# EasyEDA Pro project ProDocument_1_2024-06-25.epro

# Schematic Schematic2
Create Date: 2024-06-14; Page Name: P1; Project Name: 32血氧课设; Schematic Name: Schematic2; Update Date: 2024-06-15; Company: 嘉立创EDA; Page Size: A4; Version: V1.0
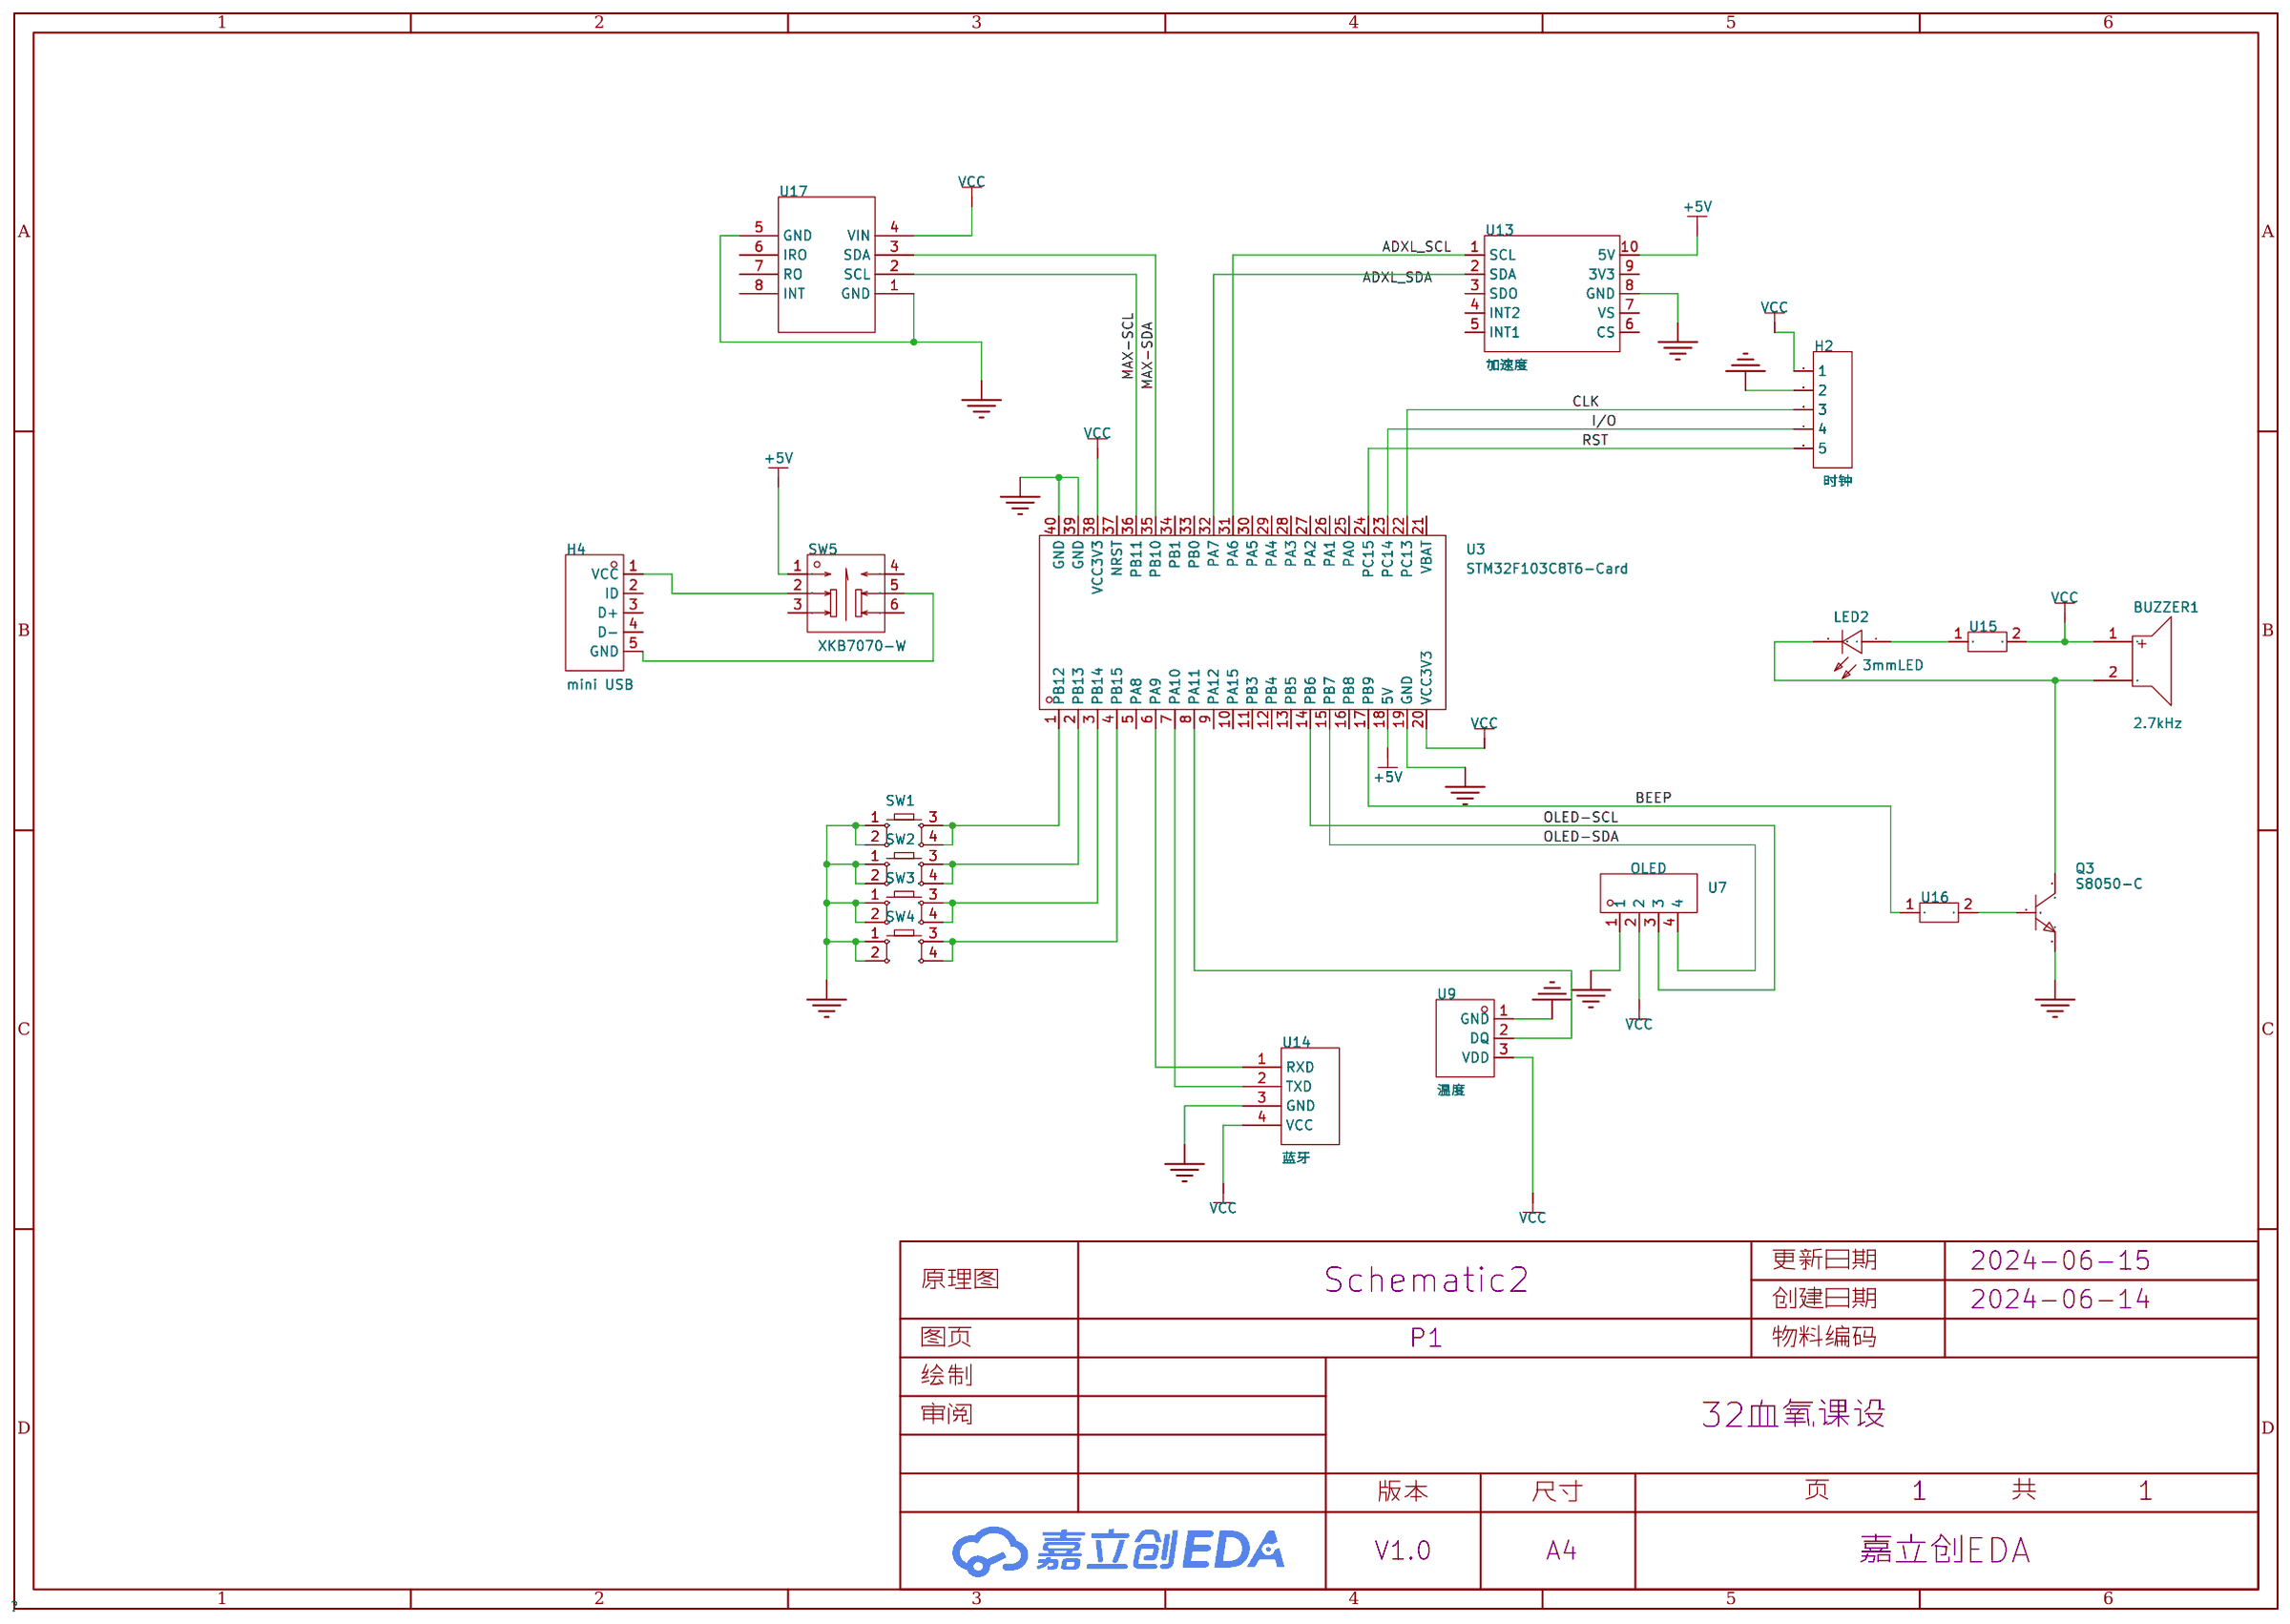
[diagram p0: schematic sheet]

## Parts
BUZZER1  2.7kHz  [BUZ-TH_BD9.0-P4.00-D0.6-FD]
H2  时钟  [HDR-TH_5P-P2.54-V-F]
H4  mini USB  [MICRO-DIP]
LED2  3mmLED  [LED-TH_BD3.8-P2.54-FD]
Q3  S8050-C  [TO-92-3_L4.9-W3.7-P1.27-R]
SW1  -  [SW-TH_4P-L6.0-W6.0-P4.50-LS6.5]
SW2  -  [SW-TH_4P-L6.0-W6.0-P4.50-LS6.5]
SW3  -  [SW-TH_4P-L6.0-W6.0-P4.50-LS6.5]
SW4  -  [SW-TH_4P-L6.0-W6.0-P4.50-LS6.5]
SW5  XKB7070-W  [SW-TH_6P-L7.2-W7.2-P2.00-LS5.0]
U3  STM32F103C8T6-Card  [CONN-TH_L53.3-W22.9_STM32F103C8T6-CARD]
U7  OLED  [OLED-TH_L27.8-W27.2-P2.54_C9900033791]
U9  温度  [HDR-TH_3P-P2.54-V-F]
U13  加速度  [ADXL345.1]
U14  蓝牙  [BT04-A]
U15  -  [R_AXIAL-0.3]
U16  -  [R_AXIAL-0.3]
U17  -  [MAX30102]

## Library data of the parts
BUZZER1 = QMB-09B-03: 驱动方式:无源(外部驱动);构造类型:电磁式;频率:2.7kHz;声压(SPL):85dB@3V,10cm;; LCSC Part Name: 无源蜂鸣器QMB-09B-03; Supplier Part: C96256; Manufacturer: 华能; Supplier Footprint: 插件,D=9mm; JLCPCB Part Class: 扩展库; Datasheet: https://atta.szlcsc.com/upload/public/pdf/source/20210401/C96256_958B17753B5AD7CBFBCFFC7C095B4484.pdf; Supplier: LCSC; Oscillator Circuit: 无源(外部驱动); Technology Type: 电磁式; Operating Voltage: 2V~5V; Sound Pressure Level (SPL): 85dB@3V,10cm; Diameter (φD): 9mm; Height: 5.7mm
H2 = HDR-F_2.54_1x5P: Supplier Part: C50950; Supplier Footprint: 插件
H4 = mini USB
LED2 = 3mmLED: LCSC Part Name: 红灯; Supplier Part: C84774; Manufacturer: EVERLIGHT(亿光); Manufacturer Part: 204-10SDRD/S530-A3-L; Supplier Footprint: 插件,D=3mm; JLCPCB Part Class: Extended Part; Datasheet: https://atta.szlcsc.com/upload/public/pdf/source/20170717/C84774_1500286941158822251.pdf; Supplier: LCSC; Emitted Color: 红灯; Lamp Holder Type: 3mm圆形灯头
Q3 = S8050-C: 晶体管类型:NPN;集电极电流(Ic):800mA;集射极击穿电压(Vceo):25V;功率(Pd):625mW;直流电流增益(hFE@Ic,Vce):120@100mA,1V;; LCSC Part Name: NPN 电流:800mA 耐压:25V; Supplier Part: C2844046; Manufacturer: BLUE ROCKET(蓝箭); Supplier Footprint: TO-92(TO-92-3); JLCPCB Part Class: 扩展库; Datasheet: https://atta.szlcsc.com/upload/public/pdf/source/20210709/C2844046_EB2B7404ACD5F985A35EF6B42E70841B.pdf; Supplier: LCSC; Transistor Type: NPN; Collector Current (Ic): 800mA; Collector-Emitter Breakdown Voltage (Vceo): 25V; Power Dissipation (Pd): 625mW; DC Current Gain (hFE@Ic,Vce): 120@100mA,1V; Transition Frequency (fT): 190MHz; Collector Cut-Off Current (Icbo): 100nA; Collector-Emitter Saturation Voltage (VCE(sat)@Ic,Ib): 280mV@500mA,50mA
SW1-SW4 = Key_SMD_6x6x6.5: Supplier Footprint: SMD
SW5 = XKB7070-W: 电路结构:-;自锁/无锁:无锁;安装方式:直插;触点电流:100mA;额定电压 (AC):250V;额定电压 (DC):30V;带灯:不带;作用力:160gf;机械寿命:1万次;; LCSC Part Name: 按键开关   7*7插件无锁 蓝白黑; Supplier Part: C318864; Manufacturer: XKB Connectivity(中国星坤); Supplier Footprint: 插件; JLCPCB Part Class: 扩展库; Datasheet: https://atta.szlcsc.com/upload/public/pdf/source/20211015/75A682A27A424BDE8D93C2CFA14C38FE.pdf; Supplier: LCSC; Self Lock / No Lock: 无锁; Actuator Style: 矩形按钮; Mounting Style: 直插; Contact Current: 100mA; Voltage Rating (AC): 250V; Voltage Rating (DC): 30V; Insulation Resistance: 100MΩ; Actuator/Cap Color: 蓝色; With Lamp: 不带; Pin Style: PC引脚; Operating Force: 160gf; Operating Temperature: -15℃~+55℃; Mechanical Life: 1万次
U3 = STM32F103C8T6-Card: Supplier Part: C9900077949; Supplier Footprint: 插件; JLCPCB Part Class: Extended Part; Supplier: LCSC
U7 = 1.3寸OLED显示屏12864: Supplier Part: C9900014198; Supplier Footprint: DIP4; JLCPCB Part Class: 扩展库; Supplier: LCSC
U9 = DS18B20: 温度范围:-55℃~+125℃;精度:±0.4℃;接口类型:-;; Supplier Part: C376006; Manufacturer: UMW(友台半导体); Supplier Footprint: TO-92; JLCPCB Part Class: Extended Part; Datasheet: https://atta.szlcsc.com/upload/public/pdf/source/20231109/DC3DA9D47D486EF40A6E0F08B9A498E3.pdf; Supplier: LCSC; Temperature range: -55℃~+125℃; Resolution: ±0.4℃; Supply Voltage: 3V~5.5V
U13 = ADXL345
U14 = BT04-A
U15 U16 = 直插电阻: 供应商封装: 0603
U17 = MAX30102

## Nets
+5V: SW5.1 U3.18(5V) U13.10(5V)
GND: H2.2 Q3.3(E) SW1.1 SW1.2 SW2.1 SW2.2 SW3.1 SW3.2 SW4.1 SW4.2 U3.19(GND) U3.39(GND) U3.40(GND) U7.1 U9.1(GND) U13.8(GND) U14.3(GND) U17.1(GND) U17.5(GND)
VCC: BUZZER1.1 H2.1 U3.20(VCC3V3) U3.38(VCC3V3) U7.2 U9.3(VDD) U14.4(VCC) U15.2 U17.4(VIN)
ADXL_SCL: U3.31(PA6) U13.1(SCL)
ADXL_SDA: U3.32(PA7) U13.2(SDA)
BEEP: U3.17(PB9) U16.1
CLK: H2.3 U3.22(PC13)
I/O: H2.4 U3.23(PC14)
MAX-SCL: U3.36(PB11) U17.2(SCL)
MAX-SDA: U3.35(PB10) U17.3(SDA)
OLED-SCL: U3.14(PB6) U7.3
OLED-SDA: U3.15(PB7) U7.4
RST: H2.5 U3.24(PC15)
$1N771: U3.8(PA11) U9.2(DQ)
$1N1221: SW1.3 SW1.4 U3.1(PB12)
$1N1232: SW2.3 SW2.4 U3.2(PB13)
$1N1243: SW3.3 SW3.4 U3.3(PB14)
$1N1254: SW4.3 SW4.4 U3.4(PB15)
$1N2247: U3.7(PA10) U14.2(TXD)
$1N2251: U3.6(PA9) U14.1(RXD)
$1N2744: LED2.1(A) U15.1
$1N8573: Q3.2(B) U16.2
$1N8948: BUZZER1.2 LED2.2(C) Q3.1(C)
Net-(H4-1): H4.1(VCC) SW5.2
Net-(H4-5): H4.5(GND) SW5.5

Not connected (* = marked no-connect by the designer): H4 2(ID) 3(D+) 4(D-); SW5 3 4 6; U3 5(PA8) 9(PA12) 10(PA15) 11(PB3) 12(PB4) 13(PB5) 16(PB8) 21(VBAT) 25(PA0) 26(PA1) 27(PA2) 28(PA3) 29(PA4) 30(PA5) 33(PB0) 34(PB1) 37(NRST); U13 3(SDO) 4(INT2) 5(INT1) 6(CS) 7(VS) 9(3V3); U17 6(IRO) 7(RO) 8(INT)

# Board PCB9
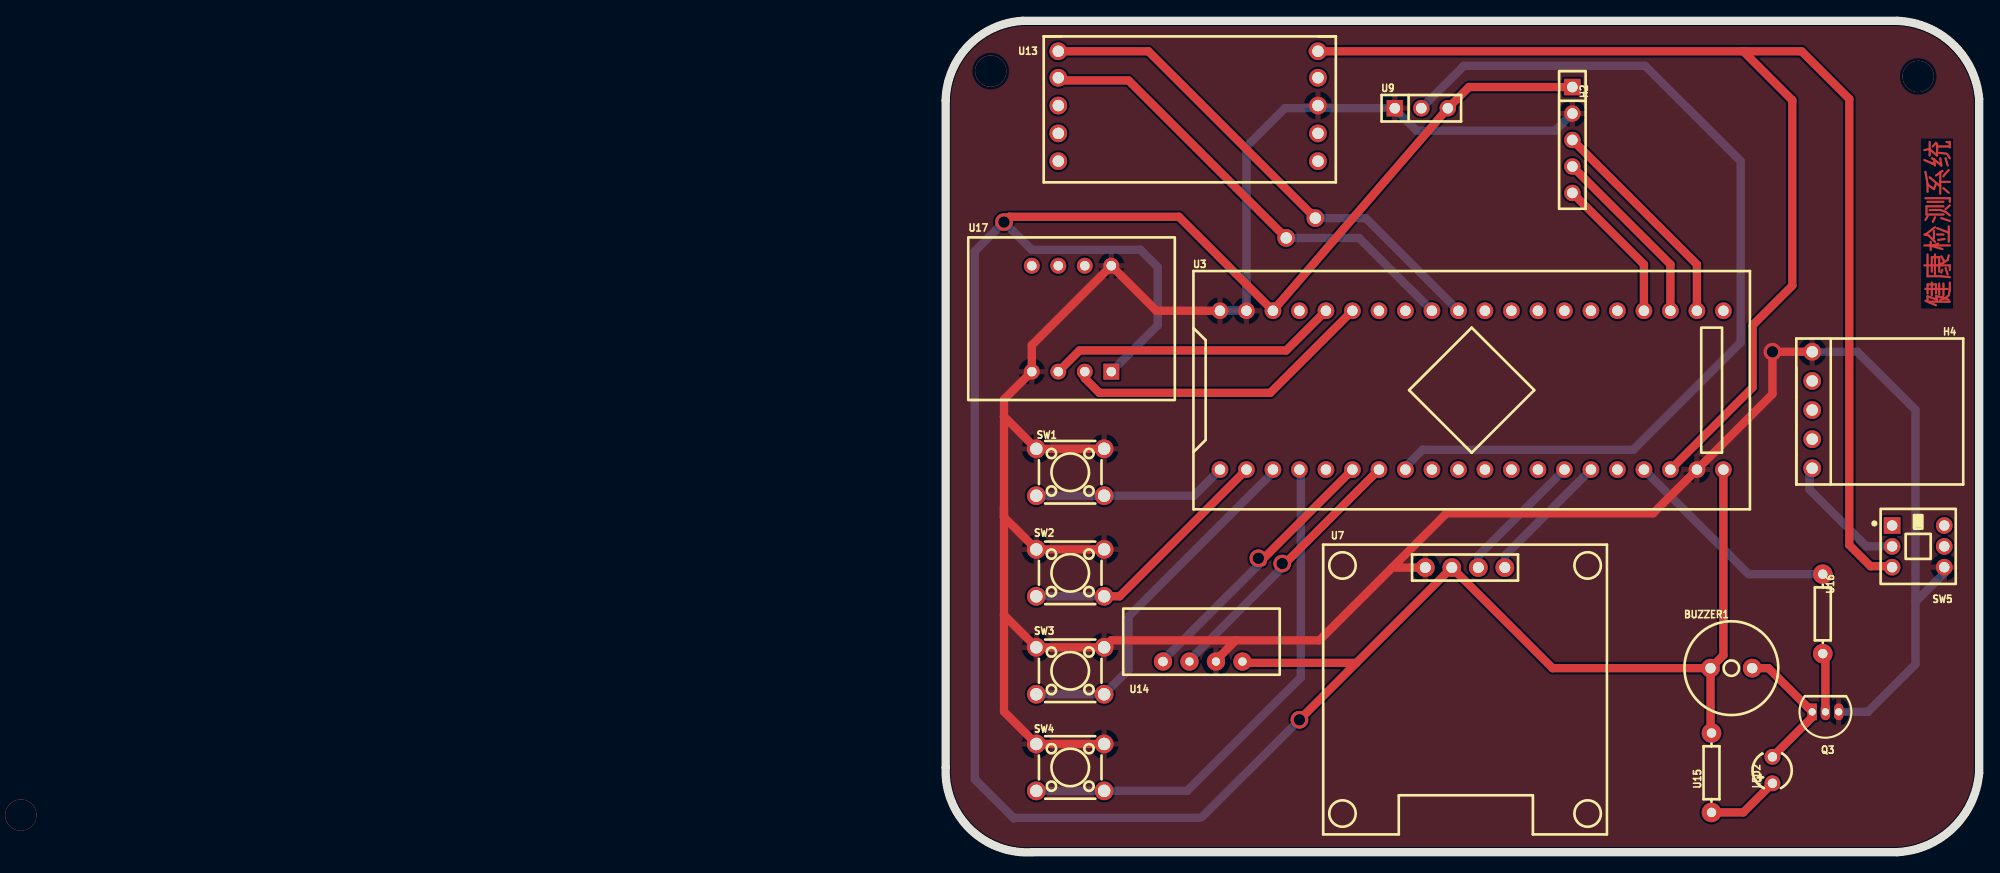
[diagram p1: board, top side]
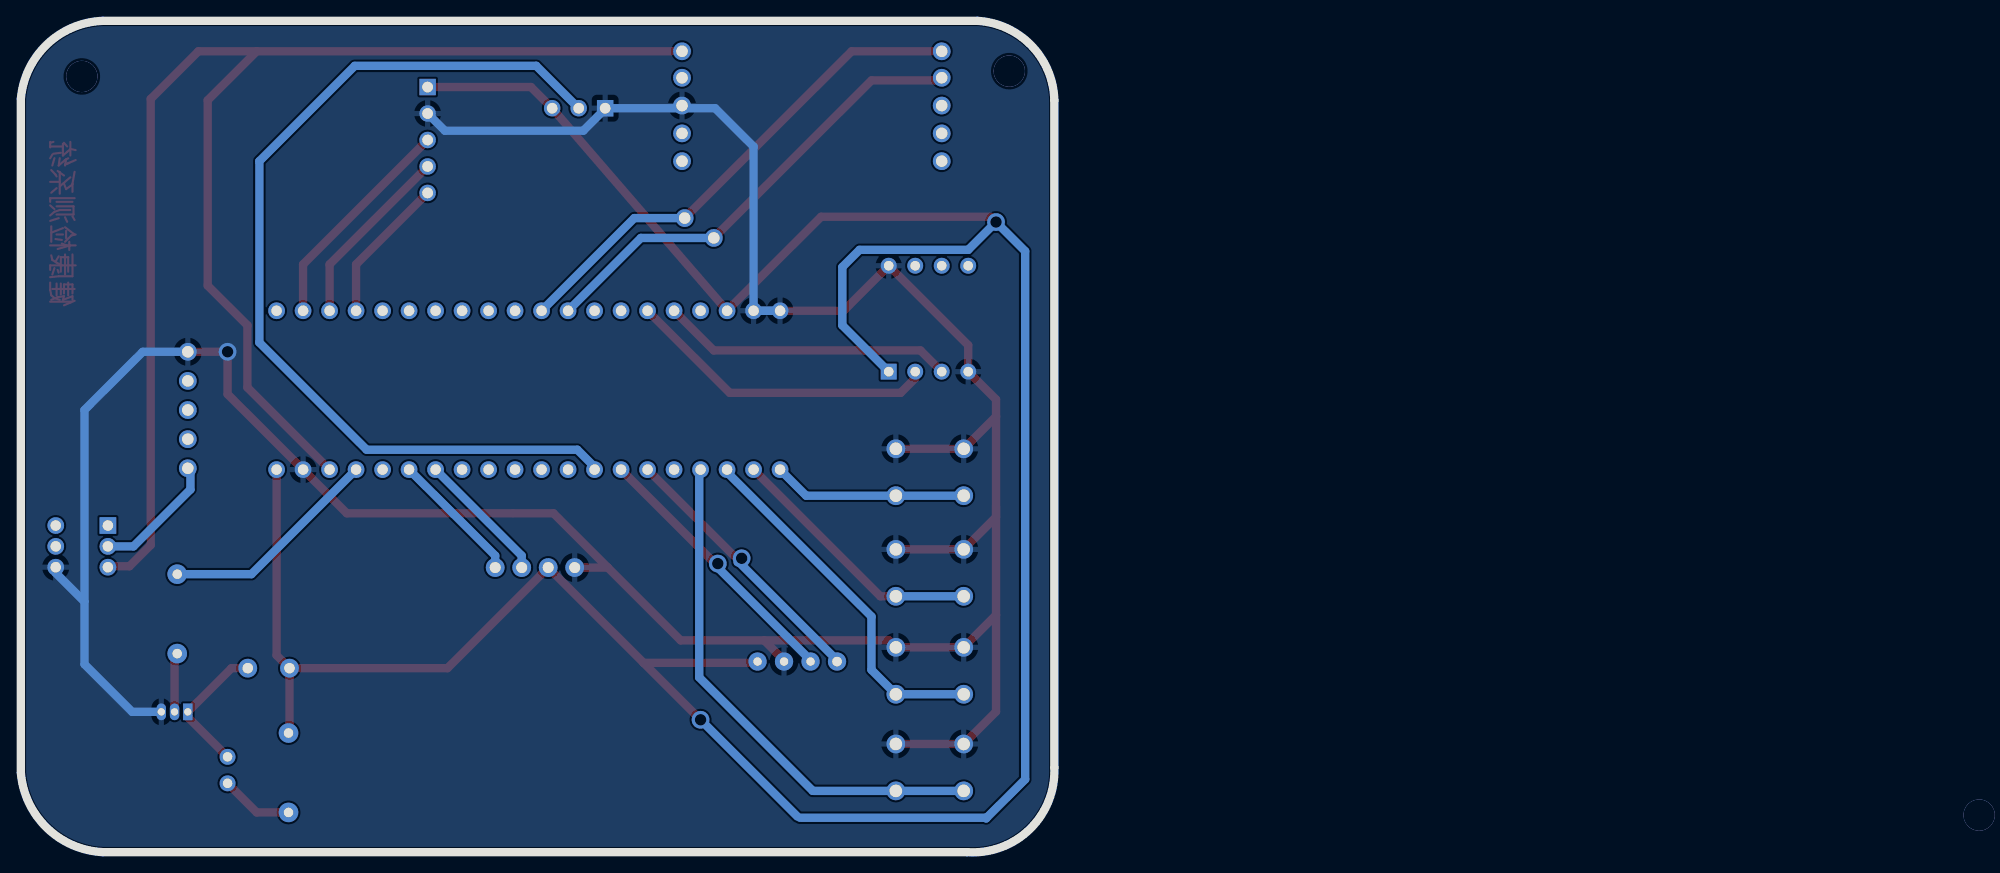
[diagram p2: board, bottom side, seen from below]

Outline 99.06 x 79.76 mm; copper layers: Top Layer, Bottom Layer. Coordinates in mm from the lower left corner of the outline.
Outline path: 0,72.14 0,8.13 arc(2.37,2.19) 8.38,0 91.19,0 arc(96.56,2.33) 99.06,7.62 99.06,72.26 arc(96.55,77.51) 91.19,79.76 7.37,79.76 arc(2.2,77.38) 0,72.14
Stack: Top Layer 0.035mm / Dielectric1 1.51mm FR4 er 4.5 / Bottom Layer 0.035mm

## Design rules (mm)
template: 自定义配置
spacing copperThickness1oz (default): track to track 0.102, other pairs 0.152 to 0.3
spacing copperThickness2oz: track to track 0.203, other pairs 0.152 to 0.3
track width copperThickness1oz (default): min 0.127, default 0.254, max 2.54
track width copperThickness2oz: min 0.203, default 0.254, max 2.54
differential pair differentialPair (default): width min 0.127, default 0.254, max 2.54; gap min 0.152, default 0.152
via viaSize (default): diameter min 0.5, default 0.61, max 10; hole min 0.3, default 0.305, max 6.3
net GND uses copperRegion1

## Placement (name value [footprint] x y rotation side)
BUZZER1  2.7kHz  [BUZ-TH_BD9.0-P4.00-D0.6-FD]  75.31 17.65 0 top
H2  时钟  [HDR-TH_5P-P2.54-V-F]  60.07 68.33 270 top
H4  mini USB  [MICRO-DIP]  97.54 49.28 180 top
LED2  3mmLED  [LED-TH_BD3.8-P2.54-FD]  79.25 7.87 90 top
NOREF  -  [Pad_e149]  32.64 58.93 180 top
NOREF#2  -  [Pad_e148]  35.43 60.83 180 top
Q3  S8050-C  [TO-92-3_L4.9-W3.7-P1.27-R]  84.33 13.46 180 top
SW1  -  [sw-th_4p-l6.0-w6.0-p4.50-ls6.5]  11.94 36.45 0 top
SW2  -  [SW-TH_4P-L6.0-W6.0-P4.50-LS6.5]  11.94 26.8 0 top
SW3  -  [SW-TH_4P-L6.0-W6.0-P4.50-LS6.5]  11.94 17.4 0 top
SW4  -  [SW-TH_4P-L6.0-W6.0-P4.50-LS6.5]  11.94 8.13 0 top
SW5  XKB7070-W  [SW-TH_6P-L7.2-W7.2-P2.00-LS5.0]  93.22 29.34 270 top
U3  STM32F103C8T6-Card  [CONN-TH_L53.3-W22.9_STM32F103C8T6-CARD]  50.42 44.32 0 top
U7  OLED  [OLED-TH_L27.8-W27.2-P2.54_C9900033791]  49.78 27.3 0 top
U9  温度  [HDR-TH_3P-P2.54-V-F]  45.59 71.37 0 top
U13  加速度  [ADXL345.1]  9.4 64.26 0 top
U14  蓝牙  [BT04-A]  20.83 18.29 90 top
U15  -  [R_AXIAL-0.3]  73.41 7.62 90 top
U16  -  [R_AXIAL-0.3]  84.07 22.86 270 top
U17  -  [MAX30102]  8.25 56.26 0 top

## Footprints (pads in the part's own frame, mm; a bottom-side part is the same pattern mirrored in y, then rotated)
ADXL345.1
  round 1.7 hole 1.1: 1(1.397,12.573) 2(1.397,10.033) 3(1.397,7.366) 4(1.397,4.699) 5(1.397,2.032) 6(26.289,2.032) 7(26.289,4.699) 8(26.289,7.366) 9(26.289,10.033) 10(26.289,12.573)
BT04-A
  round 1.75 hole 0.914x0.8: 1(0,0)
  round 1.75 hole 0.8: 2(0,-2.54) 3(0,-5.08) 4(0,-7.62)
BUZ-TH_BD9.0-P4.00-D0.6-FD
  round 1.8 hole 1: 1(-2,0) 2(2,0)
CONN-TH_L53.3-W22.9_STM32F103C8T6-CARD
  round 1.6 hole 1: 1(-24.13,-7.62) 2(-21.59,-7.62) 3(-19.05,-7.62) 4(-16.51,-7.62) 5(-13.97,-7.62) 6(-11.43,-7.62) 7(-8.89,-7.62) 8(-6.35,-7.62) 9(-3.81,-7.62) 10(-1.27,-7.62) 11(1.27,-7.62) 12(3.81,-7.62) 13(6.35,-7.62) 14(8.89,-7.62) 15(11.43,-7.62) 16(13.97,-7.62) 17(16.51,-7.62) 18(19.05,-7.62) 19(21.59,-7.62) 20(24.13,-7.62) 21(24.13,7.62) 22(21.59,7.62) 23(19.05,7.62) 24(16.51,7.62) 25(13.97,7.62) 26(11.43,7.62) 27(8.89,7.62) 28(6.35,7.62) 29(3.81,7.62) 30(1.27,7.62) 31(-1.27,7.62) 32(-3.81,7.62) 33(-6.35,7.62) 34(-8.89,7.62) 35(-11.43,7.62) 36(-13.97,7.62) 37(-16.51,7.62) 38(-19.05,7.62) 39(-21.59,7.62) 40(-24.13,7.62)
HDR-TH_3P-P2.54-V-F
  rect 1.575x1.575 hole 1.02: 1(-2.54,0)
  round 1.575 hole 1.02: 2(0,0) 3(2.54,0)
HDR-TH_5P-P2.54-V-F
  rect 1.575x1.575 hole 1.02: 1(-5.08,0)
  round 1.575 hole 1.02: 2(-2.54,0) 3(0,0) 4(2.54,0) 5(5.08,0)
LED-TH_BD3.8-P2.54-FD
  round 1.524 hole 0.899: 1(-1.27,0) 2(1.27,0)
MAX30102
  round 1.524 hole 0.914: 1(0,-10.161) 2(2.54,-10.161) 3(5.08,-10.161) 5(7.62,-0.001) 6(5.08,-0.001) 7(2.54,-0.001) 8(0,-0.001)
  rect 1.524x1.524 hole 0.914: 4(7.62,-10.161)
MICRO-DIP
  round 1.7 hole 1.1: 1(14.478,12.446) 2(14.478,9.652) 3(14.478,6.858) 4(14.478,4.064) 5(14.478,1.27)
OLED-TH_L27.8-W27.2-P2.54_C9900033791
  round 1.8 hole 1.05: 1(-3.81,0) 2(-1.27,0) 3(1.27,0) 4(3.81,0)
Pad_e148
  round 1.7 hole 1.1: 41(0,0)
Pad_e149
  round 1.7 hole 1.1: 42(0,0)
R_AXIAL-0.3
  round 1.879 hole 0.899: 1(-3.81,0) 2(3.81,0)
SW-TH_4P-L6.0-W6.0-P4.50-LS6.5
  round 1.8 hole 1.2: 1(-3.25,2.25) 2(3.25,2.25) 3(-3.25,-2.25) 4(3.25,-2.25)
sw-th_4p-l6.0-w6.0-p4.50-ls6.5
  round 1.8 hole 1.2: 1(-3.25,2.25) 2(3.25,2.25) 3(-3.25,-2.25) 4(3.25,-2.25)
SW-TH_6P-L7.2-W7.2-P2.00-LS5.0
  rect 1.6x1.6 hole 1: 1(-2,-2.5)
  round 1.6 hole 1: 2(0,-2.5) 3(2,-2.5) 4(-2,2.499) 5(0,2.5) 6(2,2.5)
TO-92-3_L4.9-W3.7-P1.27-R
  rect 0.9x1.6 hole 0.7: 1(1.27,0)
  oval 0.9x1.6 hole 0.7: 2(0,0) 3(-1.27,0)

## Nets
+5V: SW5.3 U3.18 U13.10
GND: H2.2 H4.5 Q3.3 SW1.1 SW1.2 SW2.1 SW2.2 SW3.1 SW3.2 SW4.1 SW4.2 SW5.6 U3.19 U3.39 U3.40 U7.1 U9.1 U13.8 U14.3 U17.1 U17.5
VCC: BUZZER1.1 H2.1 H4.1 SW5.2 U3.20 U3.38 U7.2 U9.3 U14.4 U15.2 U17.4
ADXL_SCL: NOREF#2.41 U3.31 U13.1
ADXL_SDA: NOREF.42 U3.32 U13.2
BEEP: U3.17 U16.1
CLK: H2.3 U3.22
I/O: H2.4 U3.23
MAX-SCL: U3.36 U17.2
MAX-SDA: U3.35 U17.3
OLED-SCL: U3.14 U7.3
OLED-SDA: U3.15 U7.4
RST: H2.5 U3.24
$1N771: U3.8 U9.2
$1N1221: SW1.3 SW1.4 U3.1
$1N1232: SW2.3 SW2.4 U3.2
$1N1243: SW3.3 SW3.4 U3.3
$1N1254: SW4.3 SW4.4 U3.4
$1N2247: U3.7 U14.2
$1N2251: U3.6 U14.1
$1N2744: LED2.1 U15.1
$1N8573: Q3.2 U16.2
$1N8948: BUZZER1.2 LED2.2 Q3.1

Pads without a net: H4 2 3 4; SW5 1 4 5; U3 5 9 10 11 12 13 16 21 25 26 27 28 29 30 33 34 37; U13 3 4 5 6 7 9; U17 6 7 8

## Via types
v1: diameter 3, hole 3, Top Layer to Bottom Layer, 3 vias
v2: diameter 1.7, hole 1.1, Top Layer to Bottom Layer, 5 vias

## Routing (per net, layer and track width the routed paths; a pad name or vN(x,y) marks a point on that pad's centre or on a via; arc(x,y) is an arc through that point)
+5V: length 148
  Top Layer w0.8: 35.19,76.84 76.46,76.84 ; 76.46,76.84 81.16,72.14 81.16,54.36 77.35,50.55 77.35,44.58 U3.18 ; 76.46,76.84 82.05,76.84 86.62,72.26 86.62,29.46 88.65,27.43 90.63,27.43 SW5.3
GND: length 298
  Top Layer w0.8: 5.59,33.16 5.59,22.75 ; 5.59,22.75 5.59,13.48 SW4.1 SW4.2 ; 5.59,22.75 SW3.1 15.34,19.65 15.37,19.69 ; SW1.2 SW1.1 5.59,41.8 5.59,32.15 SW2.1 SW2.2 ; 51.95,32.51 67.82,32.51 U3.19 79.25,43.94 v2(79.25,48.01) H4.5 ; 25.66,18.16 27.82,20.32 ; 27.82,20.32 35.82,20.32 42.81,27.31 ; 27.82,20.32 15.87,20.32 SW3.2 ; 42.81,27.31 48.01,32.51 51.82,32.51 ; 42.81,27.31 U7.1 ; 5.59,41.78 5.59,43.43 U17.1 8.26,48.64 U17.5 20.2,51.94 U3.40
  Bottom Layer w0.8: U3.39 U3.40 U3.39 ; U3.39 28.84,67.69 32.52,71.37 35.44,71.37 U13.8 35.95,71.37 U9.1 ; 42.81,71.25 43.12,71.25 45.15,69.22 58.43,69.22 H2.2 ; H4.5 87.38,48.01 92.97,42.42 92.97,24.03 ; SW5.6 95.72,26.78 92.97,24.03 ; 92.97,24.03 92.97,18.03 88.4,13.46 Q3.3
VCC: length 286.2
  Top Layer w0.8: H2.1 50.17,73.41 U9.3 31.38,51.94 22.36,60.96 6.1,60.96 v2(5.59,60.45) ; U3.20 74.56,18.89 BUZZER1.1 ; BUZZER1.1 73.32,11.53 U15.2 ; BUZZER1.1 58.17,17.65 U7.2 39.38,18.16 ; 28.2,18.16 39.38,18.16 ; 39.38,18.16 v2(33.91,12.7)
  Bottom Layer w0.8: 24.64,3.43 v2(33.91,12.7) ; U17.4 20.33,50.55 20.33,56.13 18.68,57.79 8.26,57.79 v2(5.59,60.45) 2.8,57.66 2.8,6.99 6.55,3.24 6.61,3.3 24.39,3.3 ; SW5.2 88.27,29.34 82.81,34.8 82.81,36.58 H4.1
(no net):
  vias: v1(-88.65,3.56) v1(4.32,74.93) v1(93.22,74.42)
ADXL_SCL: length 48.7
  Top Layer w0.8: 10.8,76.83 19.43,76.83 NOREF#2.41
  Bottom Layer w0.8: U3.31 40.26,60.83 NOREF#2.41
ADXL_SDA: length 45.1
  Top Layer w0.8: U13.2 11.05,74.04 17.53,74.04 NOREF.42
  Bottom Layer w0.8: NOREF.42 39.62,58.93 U3.32
BEEP: length 21.3
  Bottom Layer w0.8: U3.17 76.96,26.67 U16.1
MAX-SCL: length 28.1
  Top Layer w0.8: U3.36 32.64,48.13 12.83,48.13 U17.2
MAX-SDA: length 30.1
  Top Layer w0.8: U3.35 31.11,44.07 14.73,44.07 13.33,45.47 U17.3
OLED-SCL: length 12.8
  Bottom Layer w0.8: U7.3 51.05,28.45 U3.14
OLED-SDA: length 12.8
  Bottom Layer w0.8: U3.15 53.59,28.45 U7.4
$1N771: length 90.8
  Bottom Layer w0.8: U9.2 49.66,75.44 67.06,75.44 76.2,66.29 76.2,48.89 65.91,38.61 45.72,38.61 44.07,36.96 U3.8
$1N1221: length 18.6
  Bottom Layer w0.8: SW1.3 SW1.4 23.78,34.2 U3.1
$1N1232: length 25.2
  Top Layer w0.8: U3.2 16.67,24.55 SW2.4
  Bottom Layer w0.8: SW2.4 SW2.3
$1N1243: length 34.8
  Bottom Layer w0.8: SW3.3 SW3.4 17.53,17.49 17.53,22.61 31.37,36.45 31.37,36.7
$1N1254: length 49.9
  Bottom Layer w0.8: 8.95,5.88 15.45,5.88 15.48,5.84 ; SW4.4 23.16,5.88 34.04,16.76 34.04,36.58 U3.4
$1N2247: length 26.2
  Top Layer w0.8: 32.52,27.56 32.52,27.69 41.54,36.7
  Bottom Layer w0.8: 23.12,18.16 32.52,27.56
  vias: v2(32.26,27.69)
$1N2251: length 26.2
  Top Layer w0.8: 30.36,27.81 30.36,28.07 U3.6
  Bottom Layer w0.8: 20.58,18.16 30.23,27.81 30.36,27.81
  vias: v2(29.97,28.19)
$1N2744: length 7
  Top Layer w0.8: U15.1 76.45,3.81 LED2.1
$1N8573: length 5.7
  Top Layer w0.8: U16.2 84.33,18.8 Q3.2
$1N8948: length 13.4
  Top Layer w0.8: LED2.2 83.06,12.95 Q3.1 78.87,17.65 BUZZER1.2
CLK: length 21.3
  Top Layer w0.8: H2.3 72.02,56.39 U3.22
I/O: length 17.7
  Top Layer w0.8: H2.4 69.48,56.39 U3.23
RST: length 14.1
  Top Layer w0.8: H2.5 66.94,56.39 U3.24

## Copper pours and planes (outline as drawn; the poured copper is in the pictures)
GND on Top Layer: -11.3,88.26 106.17,88.26 106.17,-10.16 -11.3,-10.16
GND on Bottom Layer: -4.83,82.04 101.85,82.04 101.85,-5.21 -4.83,-5.21

## Text on the board
Top Layer: 健康检测系统
